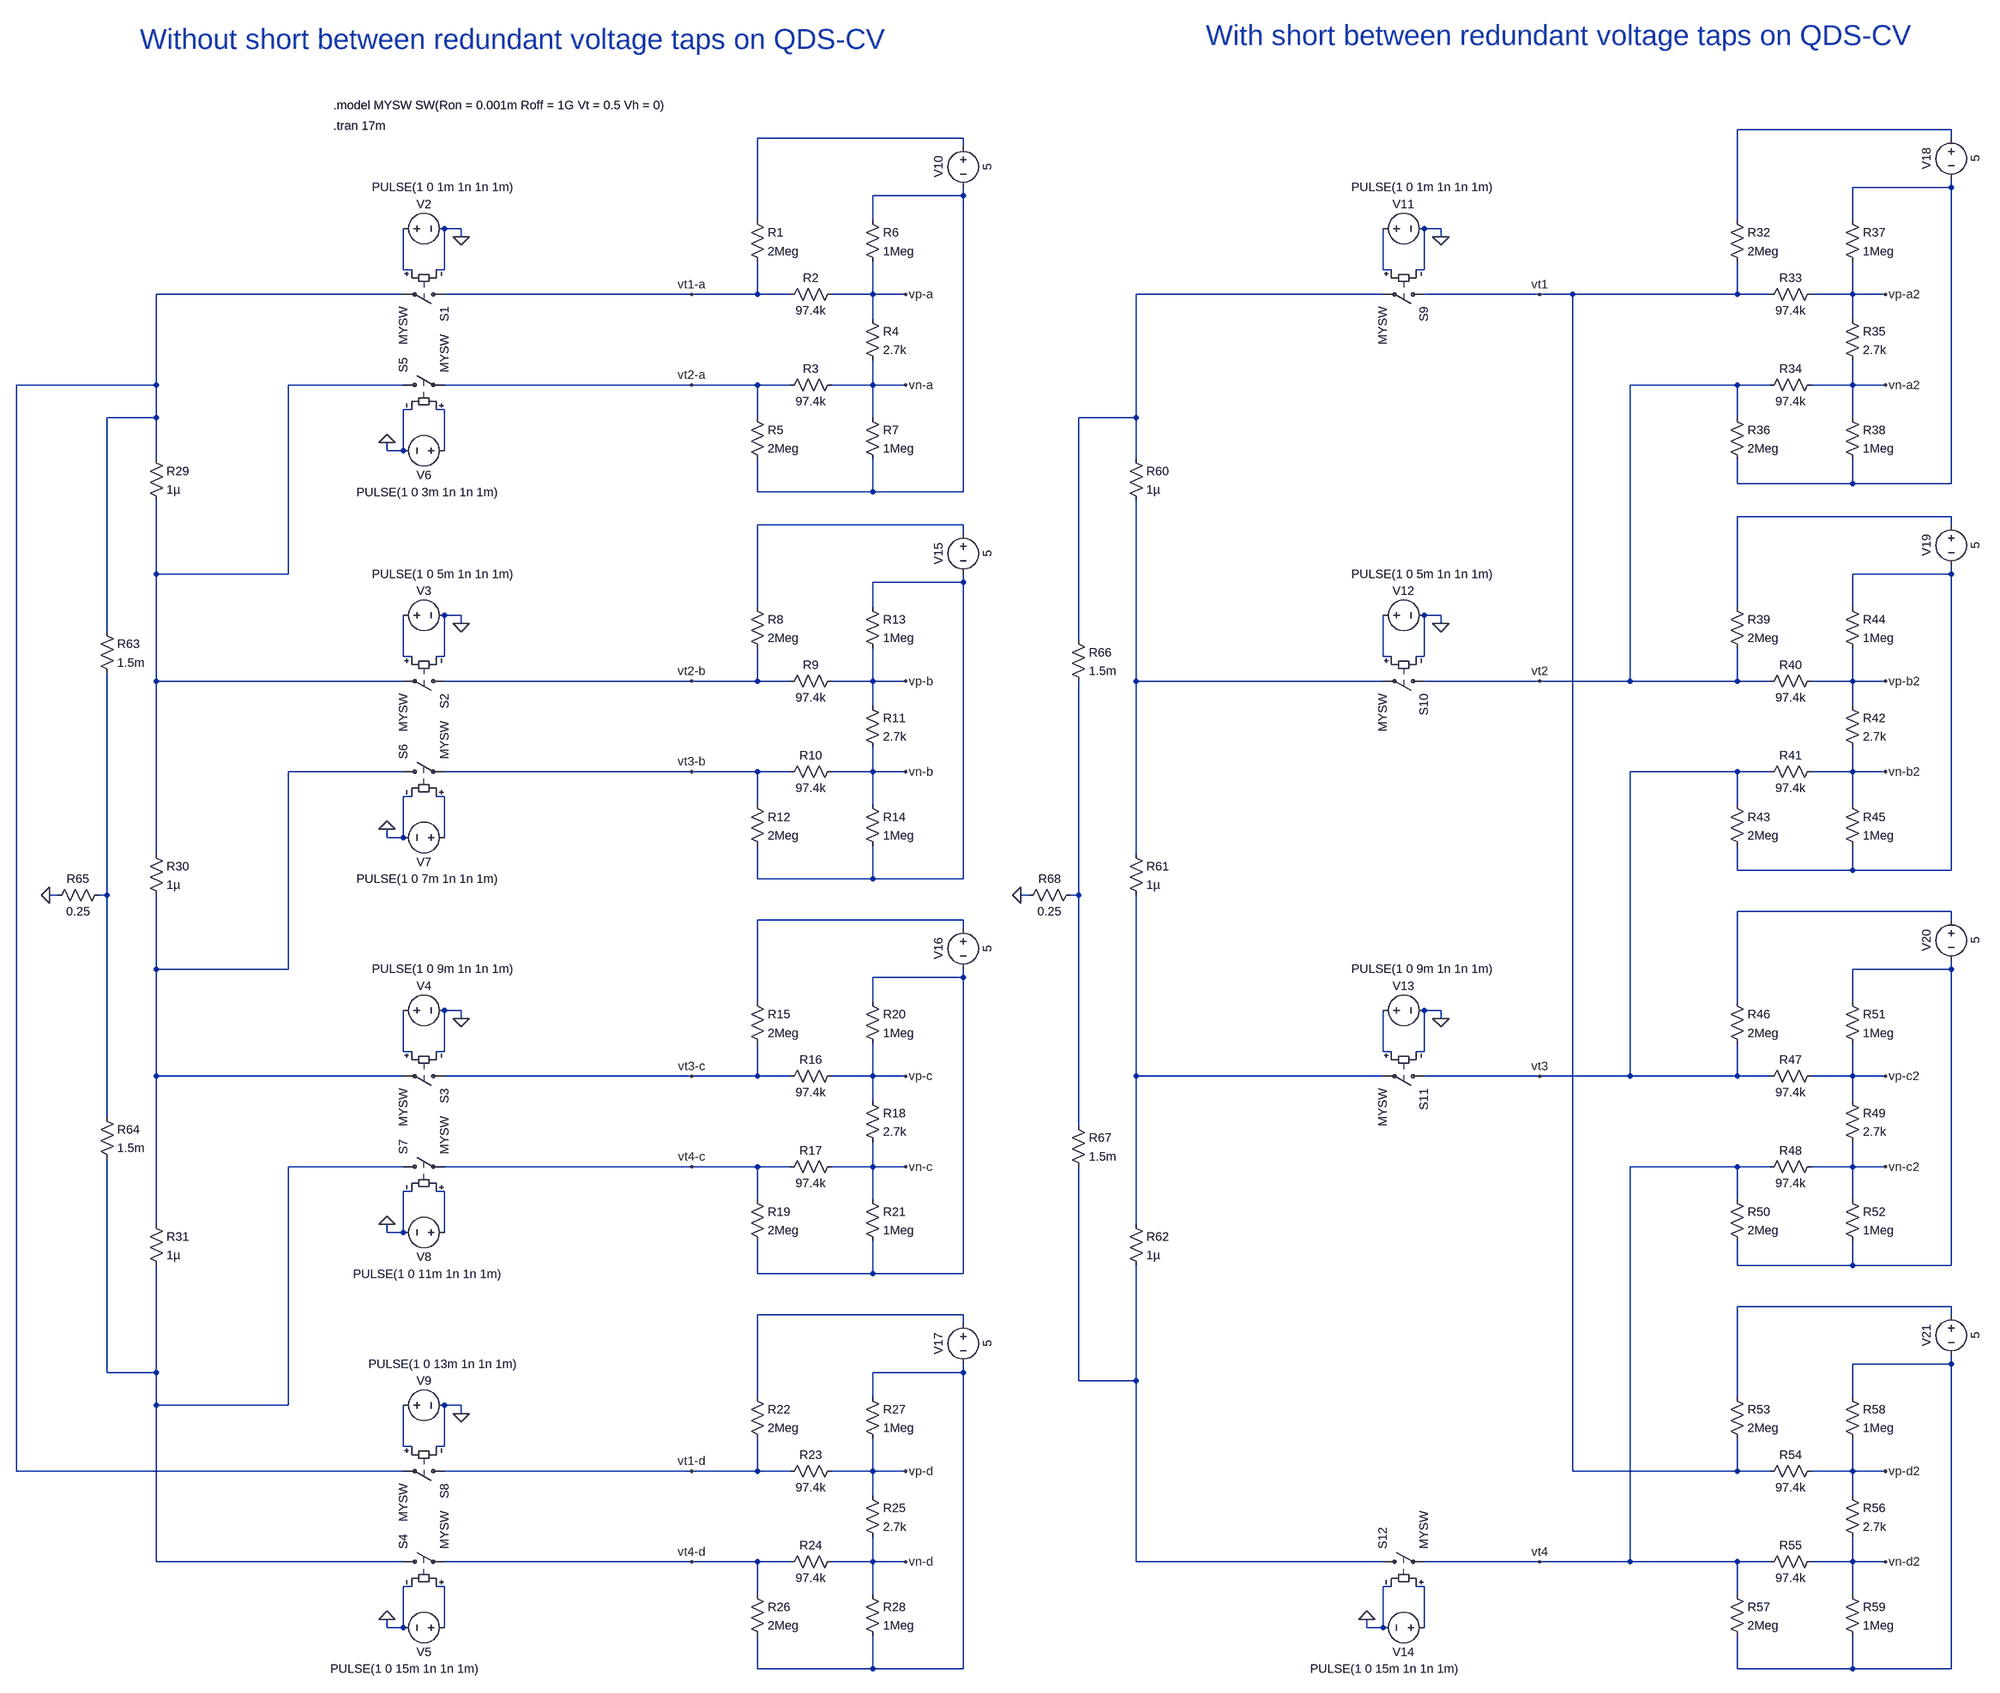
[diagram p0: schematic full-broken-wire-detection-circuit.asc]
full-broken-wire-detection-circuit.asc, the LTspice schematic file:
Version 4
SHEET 1 2824 2932
WIRE 2688 -144 2272 -144
WIRE 768 -128 368 -128
WIRE 2688 -128 2688 -144
WIRE 768 -112 768 -128
WIRE 2688 -32 2688 -48
WIRE 2688 -32 2496 -32
WIRE 768 -16 768 -32
WIRE 768 -16 592 -16
WIRE 368 32 368 -128
WIRE 592 32 592 -16
WIRE 2272 32 2272 -144
WIRE 2496 32 2496 -32
WIRE -208 48 -240 48
WIRE 1696 48 1664 48
WIRE -208 64 -208 48
WIRE 1696 64 1696 48
WIRE -320 128 -320 48
WIRE -304 128 -320 128
WIRE -240 128 -240 48
WIRE -240 128 -256 128
WIRE 1584 128 1584 48
WIRE 1600 128 1584 128
WIRE 1664 128 1664 48
WIRE 1664 128 1648 128
WIRE -320 176 -800 176
WIRE 240 176 -240 176
WIRE 368 176 368 112
WIRE 368 176 240 176
WIRE 432 176 368 176
WIRE 592 176 592 112
WIRE 592 176 512 176
WIRE 656 176 592 176
WIRE 1584 176 1104 176
WIRE 1888 176 1664 176
WIRE 1952 176 1888 176
WIRE 2272 176 2272 112
WIRE 2272 176 1952 176
WIRE 2336 176 2272 176
WIRE 2496 176 2496 112
WIRE 2496 176 2416 176
WIRE 2560 176 2496 176
WIRE 592 224 592 176
WIRE 2496 224 2496 176
WIRE -800 352 -800 176
WIRE -800 352 -1072 352
WIRE -320 352 -544 352
WIRE 240 352 -240 352
WIRE 368 352 240 352
WIRE 432 352 368 352
WIRE 592 352 592 304
WIRE 592 352 512 352
WIRE 656 352 592 352
WIRE 2272 352 2064 352
WIRE 2336 352 2272 352
WIRE 2496 352 2496 304
WIRE 2496 352 2416 352
WIRE 2560 352 2496 352
WIRE -304 400 -320 400
WIRE -240 400 -256 400
WIRE -800 416 -800 352
WIRE -800 416 -896 416
WIRE 368 416 368 352
WIRE 592 416 592 352
WIRE 1104 416 1104 176
WIRE 1104 416 992 416
WIRE 2272 416 2272 352
WIRE 2496 416 2496 352
WIRE -352 480 -352 464
WIRE -320 480 -320 400
WIRE -320 480 -352 480
WIRE -240 480 -240 400
WIRE -800 496 -800 416
WIRE 1104 496 1104 416
WIRE 2272 544 2272 496
WIRE 2496 544 2496 496
WIRE 2496 544 2272 544
WIRE 2688 544 2688 -32
WIRE 2688 544 2496 544
WIRE 368 560 368 496
WIRE 592 560 592 496
WIRE 592 560 368 560
WIRE 768 560 768 -16
WIRE 768 560 592 560
WIRE 2688 608 2272 608
WIRE 768 624 368 624
WIRE 2688 624 2688 608
WIRE 768 640 768 624
WIRE -800 720 -800 576
WIRE -544 720 -544 352
WIRE -544 720 -800 720
WIRE 2688 720 2688 704
WIRE 2688 720 2496 720
WIRE 768 736 768 720
WIRE 768 736 592 736
WIRE 368 784 368 624
WIRE 592 784 592 736
WIRE 2272 784 2272 608
WIRE 2496 784 2496 720
WIRE -208 800 -240 800
WIRE 1696 800 1664 800
WIRE -208 816 -208 800
WIRE 1696 816 1696 800
WIRE -896 832 -896 416
WIRE 992 848 992 416
WIRE -320 880 -320 800
WIRE -304 880 -320 880
WIRE -240 880 -240 800
WIRE -240 880 -256 880
WIRE 1584 880 1584 800
WIRE 1600 880 1584 880
WIRE 1664 880 1664 800
WIRE 1664 880 1648 880
WIRE -800 928 -800 720
WIRE -320 928 -800 928
WIRE 240 928 -240 928
WIRE 368 928 368 864
WIRE 368 928 240 928
WIRE 432 928 368 928
WIRE 592 928 592 864
WIRE 592 928 512 928
WIRE 656 928 592 928
WIRE 1104 928 1104 576
WIRE 1584 928 1104 928
WIRE 1888 928 1664 928
WIRE 2064 928 2064 352
WIRE 2064 928 1888 928
WIRE 2272 928 2272 864
WIRE 2272 928 2064 928
WIRE 2336 928 2272 928
WIRE 2496 928 2496 864
WIRE 2496 928 2416 928
WIRE 2560 928 2496 928
WIRE 592 976 592 928
WIRE 2496 976 2496 928
WIRE -320 1104 -544 1104
WIRE 240 1104 -240 1104
WIRE 368 1104 240 1104
WIRE 432 1104 368 1104
WIRE 592 1104 592 1056
WIRE 592 1104 512 1104
WIRE 656 1104 592 1104
WIRE 2272 1104 2064 1104
WIRE 2336 1104 2272 1104
WIRE 2496 1104 2496 1056
WIRE 2496 1104 2416 1104
WIRE 2560 1104 2496 1104
WIRE -304 1152 -320 1152
WIRE -240 1152 -256 1152
WIRE 368 1168 368 1104
WIRE 592 1168 592 1104
WIRE 2272 1168 2272 1104
WIRE 2496 1168 2496 1104
WIRE -352 1232 -352 1216
WIRE -320 1232 -320 1152
WIRE -320 1232 -352 1232
WIRE -240 1232 -240 1152
WIRE -800 1264 -800 928
WIRE 1104 1264 1104 928
WIRE 2272 1296 2272 1248
WIRE 2496 1296 2496 1248
WIRE 2496 1296 2272 1296
WIRE 2688 1296 2688 720
WIRE 2688 1296 2496 1296
WIRE 368 1312 368 1248
WIRE 592 1312 592 1248
WIRE 592 1312 368 1312
WIRE 768 1312 768 736
WIRE 768 1312 592 1312
WIRE -992 1344 -1008 1344
WIRE -896 1344 -896 912
WIRE -896 1344 -912 1344
WIRE 896 1344 880 1344
WIRE 992 1344 992 928
WIRE 992 1344 976 1344
WIRE 2688 1376 2272 1376
WIRE 768 1392 368 1392
WIRE 2688 1392 2688 1376
WIRE 768 1408 768 1392
WIRE -800 1488 -800 1344
WIRE -544 1488 -544 1104
WIRE -544 1488 -800 1488
WIRE 2688 1488 2688 1472
WIRE 2688 1488 2496 1488
WIRE 768 1504 768 1488
WIRE 768 1504 592 1504
WIRE 368 1552 368 1392
WIRE 592 1552 592 1504
WIRE 2272 1552 2272 1376
WIRE 2496 1552 2496 1488
WIRE -208 1568 -240 1568
WIRE 1696 1568 1664 1568
WIRE -208 1584 -208 1568
WIRE 1696 1584 1696 1568
WIRE -320 1648 -320 1568
WIRE -304 1648 -320 1648
WIRE -240 1648 -240 1568
WIRE -240 1648 -256 1648
WIRE 1584 1648 1584 1568
WIRE 1600 1648 1584 1648
WIRE 1664 1648 1664 1568
WIRE 1664 1648 1648 1648
WIRE -800 1696 -800 1488
WIRE -320 1696 -800 1696
WIRE 240 1696 -240 1696
WIRE 368 1696 368 1632
WIRE 368 1696 240 1696
WIRE 432 1696 368 1696
WIRE 592 1696 592 1632
WIRE 592 1696 512 1696
WIRE 656 1696 592 1696
WIRE 1104 1696 1104 1344
WIRE 1584 1696 1104 1696
WIRE 1888 1696 1664 1696
WIRE 2064 1696 2064 1104
WIRE 2064 1696 1888 1696
WIRE 2272 1696 2272 1632
WIRE 2272 1696 2064 1696
WIRE 2336 1696 2272 1696
WIRE 2496 1696 2496 1632
WIRE 2496 1696 2416 1696
WIRE 2560 1696 2496 1696
WIRE 592 1744 592 1696
WIRE 2496 1744 2496 1696
WIRE -896 1776 -896 1344
WIRE 992 1792 992 1344
WIRE -320 1872 -544 1872
WIRE 240 1872 -240 1872
WIRE 368 1872 240 1872
WIRE 432 1872 368 1872
WIRE 592 1872 592 1824
WIRE 592 1872 512 1872
WIRE 656 1872 592 1872
WIRE 2272 1872 2064 1872
WIRE 2336 1872 2272 1872
WIRE 2496 1872 2496 1824
WIRE 2496 1872 2416 1872
WIRE 2560 1872 2496 1872
WIRE -304 1920 -320 1920
WIRE -240 1920 -256 1920
WIRE 368 1936 368 1872
WIRE 592 1936 592 1872
WIRE 2272 1936 2272 1872
WIRE 2496 1936 2496 1872
WIRE -800 1984 -800 1696
WIRE 1104 1984 1104 1696
WIRE -352 2000 -352 1984
WIRE -320 2000 -320 1920
WIRE -320 2000 -352 2000
WIRE -240 2000 -240 1920
WIRE 2272 2064 2272 2016
WIRE 2496 2064 2496 2016
WIRE 2496 2064 2272 2064
WIRE 2688 2064 2688 1488
WIRE 2688 2064 2496 2064
WIRE 368 2080 368 2016
WIRE 592 2080 592 2016
WIRE 592 2080 368 2080
WIRE 768 2080 768 1504
WIRE 768 2080 592 2080
WIRE 2688 2144 2272 2144
WIRE 768 2160 368 2160
WIRE 2688 2160 2688 2144
WIRE 768 2176 768 2160
WIRE 2688 2256 2688 2240
WIRE 2688 2256 2496 2256
WIRE -896 2272 -896 1856
WIRE -800 2272 -800 2064
WIRE -800 2272 -896 2272
WIRE 768 2272 768 2256
WIRE 768 2272 592 2272
WIRE 992 2288 992 1872
WIRE 1104 2288 1104 2064
WIRE 1104 2288 992 2288
WIRE 368 2320 368 2160
WIRE 592 2320 592 2272
WIRE 2272 2320 2272 2144
WIRE 2496 2320 2496 2256
WIRE -800 2336 -800 2272
WIRE -544 2336 -544 1872
WIRE -544 2336 -800 2336
WIRE -208 2336 -240 2336
WIRE -208 2352 -208 2336
WIRE -320 2416 -320 2336
WIRE -304 2416 -320 2416
WIRE -240 2416 -240 2336
WIRE -240 2416 -256 2416
WIRE -1072 2464 -1072 352
WIRE -320 2464 -1072 2464
WIRE 240 2464 -240 2464
WIRE 368 2464 368 2400
WIRE 368 2464 240 2464
WIRE 432 2464 368 2464
WIRE 592 2464 592 2400
WIRE 592 2464 512 2464
WIRE 656 2464 592 2464
WIRE 1952 2464 1952 176
WIRE 2272 2464 2272 2400
WIRE 2272 2464 1952 2464
WIRE 2336 2464 2272 2464
WIRE 2496 2464 2496 2400
WIRE 2496 2464 2416 2464
WIRE 2560 2464 2496 2464
WIRE 592 2512 592 2464
WIRE 2496 2512 2496 2464
WIRE -800 2640 -800 2336
WIRE -320 2640 -800 2640
WIRE 240 2640 -240 2640
WIRE 368 2640 240 2640
WIRE 432 2640 368 2640
WIRE 592 2640 592 2592
WIRE 592 2640 512 2640
WIRE 656 2640 592 2640
WIRE 1104 2640 1104 2288
WIRE 1584 2640 1104 2640
WIRE 1888 2640 1664 2640
WIRE 2064 2640 2064 1872
WIRE 2064 2640 1888 2640
WIRE 2272 2640 2064 2640
WIRE 2336 2640 2272 2640
WIRE 2496 2640 2496 2592
WIRE 2496 2640 2416 2640
WIRE 2560 2640 2496 2640
WIRE -304 2688 -320 2688
WIRE -240 2688 -256 2688
WIRE 1600 2688 1584 2688
WIRE 1664 2688 1648 2688
WIRE 368 2704 368 2640
WIRE 592 2704 592 2640
WIRE 2272 2704 2272 2640
WIRE 2496 2704 2496 2640
WIRE -352 2768 -352 2752
WIRE -320 2768 -320 2688
WIRE -320 2768 -352 2768
WIRE -240 2768 -240 2688
WIRE 1552 2768 1552 2752
WIRE 1584 2768 1584 2688
WIRE 1584 2768 1552 2768
WIRE 1664 2768 1664 2688
WIRE 368 2848 368 2784
WIRE 592 2848 592 2784
WIRE 592 2848 368 2848
WIRE 768 2848 768 2272
WIRE 768 2848 592 2848
WIRE 2272 2848 2272 2784
WIRE 2496 2848 2496 2784
WIRE 2496 2848 2272 2848
WIRE 2688 2848 2688 2256
WIRE 2688 2848 2496 2848
FLAG -208 64 0
FLAG -208 816 0
FLAG -208 1584 0
FLAG -352 2752 0
FLAG 240 176 vt1-a
FLAG 240 352 vt2-a
FLAG 240 1104 vt3-b
FLAG 240 1872 vt4-c
FLAG 240 928 vt2-b
FLAG 240 1696 vt3-c
FLAG 240 2640 vt4-d
FLAG 240 2464 vt1-d
FLAG -352 464 0
FLAG -352 1216 0
FLAG -352 1984 0
FLAG -208 2352 0
FLAG 656 176 vp-a
FLAG 656 352 vn-a
FLAG 656 928 vp-b
FLAG 656 1104 vn-b
FLAG 656 1696 vp-c
FLAG 656 1872 vn-c
FLAG 656 2464 vp-d
FLAG 656 2640 vn-d
FLAG 1696 64 0
FLAG 1696 816 0
FLAG 1696 1584 0
FLAG 1552 2752 0
FLAG 1888 176 vt1
FLAG 1888 928 vt2
FLAG 1888 1696 vt3
FLAG 1888 2640 vt4
FLAG 2560 176 vp-a2
FLAG 2560 352 vn-a2
FLAG 2560 928 vp-b2
FLAG 2560 1104 vn-b2
FLAG 2560 1696 vp-c2
FLAG 2560 1872 vn-c2
FLAG 2560 2464 vp-d2
FLAG 2560 2640 vn-d2
FLAG -1008 1344 0
FLAG 880 1344 0
SYMBOL res 352 16 R0
SYMATTR InstName R1
SYMATTR Value 2Meg
SYMBOL res 528 160 R90
WINDOW 0 0 56 VBottom 2
WINDOW 3 32 56 VTop 2
SYMATTR InstName R2
SYMATTR Value 97.4k
SYMBOL res 528 336 R90
WINDOW 0 0 56 VBottom 2
WINDOW 3 32 56 VTop 2
SYMATTR InstName R3
SYMATTR Value 97.4k
SYMBOL res 576 208 R0
SYMATTR InstName R4
SYMATTR Value 2.7k
SYMBOL res 352 400 R0
SYMATTR InstName R5
SYMATTR Value 2Meg
SYMBOL sw -224 176 R90
SYMATTR InstName S1
SYMATTR Value MYSW
SYMBOL voltage -336 48 R270
WINDOW 0 32 56 VTop 2
WINDOW 3 96 93 VBottom 2
WINDOW 123 0 0 Left 0
WINDOW 39 0 0 Left 0
SYMATTR InstName V2
SYMATTR Value PULSE(1 0 1m 1n 1n 1m)
SYMBOL res 576 16 R0
SYMATTR InstName R6
SYMATTR Value 1Meg
SYMBOL res 576 400 R0
SYMATTR InstName R7
SYMATTR Value 1Meg
SYMBOL res 352 768 R0
SYMATTR InstName R8
SYMATTR Value 2Meg
SYMBOL res 528 912 R90
WINDOW 0 0 56 VBottom 2
WINDOW 3 32 56 VTop 2
SYMATTR InstName R9
SYMATTR Value 97.4k
SYMBOL res 528 1088 R90
WINDOW 0 0 56 VBottom 2
WINDOW 3 32 56 VTop 2
SYMATTR InstName R10
SYMATTR Value 97.4k
SYMBOL res 576 960 R0
SYMATTR InstName R11
SYMATTR Value 2.7k
SYMBOL res 352 1152 R0
SYMATTR InstName R12
SYMATTR Value 2Meg
SYMBOL sw -224 928 R90
SYMATTR InstName S2
SYMATTR Value MYSW
SYMBOL res 576 768 R0
SYMATTR InstName R13
SYMATTR Value 1Meg
SYMBOL res 576 1152 R0
SYMATTR InstName R14
SYMATTR Value 1Meg
SYMBOL res 352 1536 R0
SYMATTR InstName R15
SYMATTR Value 2Meg
SYMBOL res 528 1680 R90
WINDOW 0 0 56 VBottom 2
WINDOW 3 32 56 VTop 2
SYMATTR InstName R16
SYMATTR Value 97.4k
SYMBOL res 528 1856 R90
WINDOW 0 0 56 VBottom 2
WINDOW 3 32 56 VTop 2
SYMATTR InstName R17
SYMATTR Value 97.4k
SYMBOL res 576 1728 R0
SYMATTR InstName R18
SYMATTR Value 2.7k
SYMBOL res 352 1920 R0
SYMATTR InstName R19
SYMATTR Value 2Meg
SYMBOL sw -224 1696 R90
SYMATTR InstName S3
SYMATTR Value MYSW
SYMBOL res 576 1536 R0
SYMATTR InstName R20
SYMATTR Value 1Meg
SYMBOL res 576 1920 R0
SYMATTR InstName R21
SYMATTR Value 1Meg
SYMBOL res 352 2304 R0
SYMATTR InstName R22
SYMATTR Value 2Meg
SYMBOL res 528 2448 R90
WINDOW 0 0 56 VBottom 2
WINDOW 3 32 56 VTop 2
SYMATTR InstName R23
SYMATTR Value 97.4k
SYMBOL res 528 2624 R90
WINDOW 0 0 56 VBottom 2
WINDOW 3 32 56 VTop 2
SYMATTR InstName R24
SYMATTR Value 97.4k
SYMBOL res 576 2496 R0
SYMATTR InstName R25
SYMATTR Value 2.7k
SYMBOL res 352 2688 R0
SYMATTR InstName R26
SYMATTR Value 2Meg
SYMBOL sw -336 2640 R270
SYMATTR InstName S4
SYMATTR Value MYSW
SYMBOL res 576 2304 R0
SYMATTR InstName R27
SYMATTR Value 1Meg
SYMBOL res 576 2688 R0
SYMATTR InstName R28
SYMATTR Value 1Meg
SYMBOL res -816 480 R0
SYMATTR InstName R29
SYMATTR Value 1µ
SYMBOL res -816 1248 R0
SYMATTR InstName R30
SYMATTR Value 1µ
SYMBOL res -816 1968 R0
SYMATTR InstName R31
SYMATTR Value 1µ
SYMBOL voltage -336 800 R270
WINDOW 0 32 56 VTop 2
WINDOW 3 96 93 VBottom 2
WINDOW 123 0 0 Left 0
WINDOW 39 0 0 Left 0
SYMATTR InstName V3
SYMATTR Value PULSE(1 0 5m 1n 1n 1m)
SYMBOL voltage -336 1568 R270
WINDOW 0 32 56 VTop 2
WINDOW 3 96 93 VBottom 2
WINDOW 123 0 0 Left 0
WINDOW 39 0 0 Left 0
SYMATTR InstName V4
SYMATTR Value PULSE(1 0 9m 1n 1n 1m)
SYMBOL voltage -224 2768 R90
WINDOW 0 32 56 VTop 2
WINDOW 3 96 93 VBottom 2
WINDOW 123 0 0 Left 0
WINDOW 39 0 0 Left 0
SYMATTR InstName V5
SYMATTR Value PULSE(1 0 15m 1n 1n 1m)
SYMBOL sw -336 352 R270
SYMATTR InstName S5
SYMATTR Value MYSW
SYMBOL voltage -224 480 R90
WINDOW 0 32 56 VTop 2
WINDOW 3 96 49 VBottom 2
WINDOW 123 0 0 Left 0
WINDOW 39 0 0 Left 0
SYMATTR InstName V6
SYMATTR Value PULSE(1 0 3m 1n 1n 1m)
SYMBOL sw -336 1104 R270
SYMATTR InstName S6
SYMATTR Value MYSW
SYMBOL voltage -224 1232 R90
WINDOW 0 32 56 VTop 2
WINDOW 3 96 49 VBottom 2
WINDOW 123 0 0 Left 0
WINDOW 39 0 0 Left 0
SYMATTR InstName V7
SYMATTR Value PULSE(1 0 7m 1n 1n 1m)
SYMBOL sw -336 1872 R270
SYMATTR InstName S7
SYMATTR Value MYSW
SYMBOL voltage -224 2000 R90
WINDOW 0 32 56 VTop 2
WINDOW 3 96 49 VBottom 2
WINDOW 123 0 0 Left 0
WINDOW 39 0 0 Left 0
SYMATTR InstName V8
SYMATTR Value PULSE(1 0 11m 1n 1n 1m)
SYMBOL sw -224 2464 R90
SYMATTR InstName S8
SYMATTR Value MYSW
SYMBOL voltage -336 2336 R270
WINDOW 0 32 56 VTop 2
WINDOW 3 96 93 VBottom 2
WINDOW 123 0 0 Left 0
WINDOW 39 0 0 Left 0
SYMATTR InstName V9
SYMATTR Value PULSE(1 0 13m 1n 1n 1m)
SYMBOL res 2256 16 R0
SYMATTR InstName R32
SYMATTR Value 2Meg
SYMBOL res 2432 160 R90
WINDOW 0 0 56 VBottom 2
WINDOW 3 32 56 VTop 2
SYMATTR InstName R33
SYMATTR Value 97.4k
SYMBOL res 2432 336 R90
WINDOW 0 0 56 VBottom 2
WINDOW 3 32 56 VTop 2
SYMATTR InstName R34
SYMATTR Value 97.4k
SYMBOL res 2480 208 R0
SYMATTR InstName R35
SYMATTR Value 2.7k
SYMBOL res 2256 400 R0
SYMATTR InstName R36
SYMATTR Value 2Meg
SYMBOL sw 1680 176 R90
SYMATTR InstName S9
SYMATTR Value MYSW
SYMBOL voltage 1568 48 R270
WINDOW 0 32 56 VTop 2
WINDOW 3 96 93 VBottom 2
WINDOW 123 0 0 Left 0
WINDOW 39 0 0 Left 0
SYMATTR InstName V11
SYMATTR Value PULSE(1 0 1m 1n 1n 1m)
SYMBOL res 2480 16 R0
SYMATTR InstName R37
SYMATTR Value 1Meg
SYMBOL res 2480 400 R0
SYMATTR InstName R38
SYMATTR Value 1Meg
SYMBOL res 2256 768 R0
SYMATTR InstName R39
SYMATTR Value 2Meg
SYMBOL res 2432 912 R90
WINDOW 0 0 56 VBottom 2
WINDOW 3 32 56 VTop 2
SYMATTR InstName R40
SYMATTR Value 97.4k
SYMBOL res 2432 1088 R90
WINDOW 0 0 56 VBottom 2
WINDOW 3 32 56 VTop 2
SYMATTR InstName R41
SYMATTR Value 97.4k
SYMBOL res 2480 960 R0
SYMATTR InstName R42
SYMATTR Value 2.7k
SYMBOL res 2256 1152 R0
SYMATTR InstName R43
SYMATTR Value 2Meg
SYMBOL sw 1680 928 R90
SYMATTR InstName S10
SYMATTR Value MYSW
SYMBOL res 2480 768 R0
SYMATTR InstName R44
SYMATTR Value 1Meg
SYMBOL res 2480 1152 R0
SYMATTR InstName R45
SYMATTR Value 1Meg
SYMBOL res 2256 1536 R0
SYMATTR InstName R46
SYMATTR Value 2Meg
SYMBOL res 2432 1680 R90
WINDOW 0 0 56 VBottom 2
WINDOW 3 32 56 VTop 2
SYMATTR InstName R47
SYMATTR Value 97.4k
SYMBOL res 2432 1856 R90
WINDOW 0 0 56 VBottom 2
WINDOW 3 32 56 VTop 2
SYMATTR InstName R48
SYMATTR Value 97.4k
SYMBOL res 2480 1728 R0
SYMATTR InstName R49
SYMATTR Value 2.7k
SYMBOL res 2256 1920 R0
SYMATTR InstName R50
SYMATTR Value 2Meg
SYMBOL sw 1680 1696 R90
SYMATTR InstName S11
SYMATTR Value MYSW
SYMBOL res 2480 1536 R0
SYMATTR InstName R51
SYMATTR Value 1Meg
SYMBOL res 2480 1920 R0
SYMATTR InstName R52
SYMATTR Value 1Meg
SYMBOL res 2256 2304 R0
SYMATTR InstName R53
SYMATTR Value 2Meg
SYMBOL res 2432 2448 R90
WINDOW 0 0 56 VBottom 2
WINDOW 3 32 56 VTop 2
SYMATTR InstName R54
SYMATTR Value 97.4k
SYMBOL res 2432 2624 R90
WINDOW 0 0 56 VBottom 2
WINDOW 3 32 56 VTop 2
SYMATTR InstName R55
SYMATTR Value 97.4k
SYMBOL res 2480 2496 R0
SYMATTR InstName R56
SYMATTR Value 2.7k
SYMBOL res 2256 2688 R0
SYMATTR InstName R57
SYMATTR Value 2Meg
SYMBOL sw 1568 2640 R270
SYMATTR InstName S12
SYMATTR Value MYSW
SYMBOL res 2480 2304 R0
SYMATTR InstName R58
SYMATTR Value 1Meg
SYMBOL res 2480 2688 R0
SYMATTR InstName R59
SYMATTR Value 1Meg
SYMBOL res 1088 480 R0
SYMATTR InstName R60
SYMATTR Value 1µ
SYMBOL res 1088 1248 R0
SYMATTR InstName R61
SYMATTR Value 1µ
SYMBOL res 1088 1968 R0
SYMATTR InstName R62
SYMATTR Value 1µ
SYMBOL voltage 1568 800 R270
WINDOW 0 32 56 VTop 2
WINDOW 3 96 93 VBottom 2
WINDOW 123 0 0 Left 0
WINDOW 39 0 0 Left 0
SYMATTR InstName V12
SYMATTR Value PULSE(1 0 5m 1n 1n 1m)
SYMBOL voltage 1568 1568 R270
WINDOW 0 32 56 VTop 2
WINDOW 3 96 93 VBottom 2
WINDOW 123 0 0 Left 0
WINDOW 39 0 0 Left 0
SYMATTR InstName V13
SYMATTR Value PULSE(1 0 9m 1n 1n 1m)
SYMBOL voltage 1680 2768 R90
WINDOW 0 32 56 VTop 2
WINDOW 3 96 93 VBottom 2
WINDOW 123 0 0 Left 0
WINDOW 39 0 0 Left 0
SYMATTR InstName V14
SYMATTR Value PULSE(1 0 15m 1n 1n 1m)
SYMBOL voltage 768 -128 R0
WINDOW 0 -32 56 VBottom 2
WINDOW 3 32 56 VTop 2
WINDOW 123 0 0 Left 0
WINDOW 39 0 0 Left 0
SYMATTR InstName V10
SYMATTR Value 5
SYMBOL voltage 768 624 R0
WINDOW 0 -32 56 VBottom 2
WINDOW 3 32 56 VTop 2
WINDOW 123 0 0 Left 0
WINDOW 39 0 0 Left 0
SYMATTR InstName V15
SYMATTR Value 5
SYMBOL voltage 768 1392 R0
WINDOW 0 -32 56 VBottom 2
WINDOW 3 32 56 VTop 2
WINDOW 123 0 0 Left 0
WINDOW 39 0 0 Left 0
SYMATTR InstName V16
SYMATTR Value 5
SYMBOL voltage 768 2160 R0
WINDOW 0 -32 56 VBottom 2
WINDOW 3 32 56 VTop 2
WINDOW 123 0 0 Left 0
WINDOW 39 0 0 Left 0
SYMATTR InstName V17
SYMATTR Value 5
SYMBOL res -912 816 R0
SYMATTR InstName R63
SYMATTR Value 1.5m
SYMBOL res -912 1760 R0
SYMATTR InstName R64
SYMATTR Value 1.5m
SYMBOL res -896 1328 R90
WINDOW 0 0 56 VBottom 2
WINDOW 3 32 56 VTop 2
SYMATTR InstName R65
SYMATTR Value 0.25
SYMBOL voltage 2688 -144 R0
WINDOW 0 -32 56 VBottom 2
WINDOW 3 32 56 VTop 2
WINDOW 123 0 0 Left 0
WINDOW 39 0 0 Left 0
SYMATTR InstName V18
SYMATTR Value 5
SYMBOL voltage 2688 608 R0
WINDOW 0 -32 56 VBottom 2
WINDOW 3 32 56 VTop 2
WINDOW 123 0 0 Left 0
WINDOW 39 0 0 Left 0
SYMATTR InstName V19
SYMATTR Value 5
SYMBOL voltage 2688 1376 R0
WINDOW 0 -32 56 VBottom 2
WINDOW 3 32 56 VTop 2
WINDOW 123 0 0 Left 0
WINDOW 39 0 0 Left 0
SYMATTR InstName V20
SYMATTR Value 5
SYMBOL voltage 2688 2144 R0
WINDOW 0 -32 56 VBottom 2
WINDOW 3 32 56 VTop 2
WINDOW 123 0 0 Left 0
WINDOW 39 0 0 Left 0
SYMATTR InstName V21
SYMATTR Value 5
SYMBOL res 976 832 R0
SYMATTR InstName R66
SYMATTR Value 1.5m
SYMBOL res 976 1776 R0
SYMATTR InstName R67
SYMATTR Value 1.5m
SYMBOL res 992 1328 R90
WINDOW 0 0 56 VBottom 2
WINDOW 3 32 56 VTop 2
SYMATTR InstName R68
SYMATTR Value 0.25
TEXT -456 -152 Left 2 !.tran 17m
TEXT -456 -192 Left 2 !.model MYSW SW(Ron = 0.001m Roff = 1G Vt = 0.5 Vh = 0)
TEXT -832 -320 Left 5 ;Without short between redundant voltage taps on QDS-CV
TEXT 1240 -328 Left 5 ;With short between redundant voltage taps on QDS-CV

The netlist it stands for:
* full-broken-wire-detection-circuit.asc
R1 N002 vt1-a 2Meg
R2 vp-a vt1-a 97.4k
R3 vn-a vt2-a 97.4k
R4 vp-a vn-a 2.7k
R5 vt2-a N004 2Meg
S1 vt1-a N007 N005 0 MYSW
V2 N005 0 PULSE(1 0 1m 1n 1n 1m)
R6 N004 vp-a 1Meg
R7 vn-a N004 1Meg
R8 N012 vt2-b 2Meg
R9 vp-b vt2-b 97.4k
R10 vn-b vt3-b 97.4k
R11 vp-b vn-b 2.7k
R12 vt3-b N014 2Meg
S2 vt2-b N009 N015 0 MYSW
R13 N014 vp-b 1Meg
R14 vn-b N014 1Meg
R15 N023 vt3-c 2Meg
R16 vp-c vt3-c 97.4k
R17 vn-c vt4-c 97.4k
R18 vp-c vn-c 2.7k
R19 vt4-c N025 2Meg
S3 vt3-c N018 N026 0 MYSW
R20 N025 vp-c 1Meg
R21 vn-c N025 1Meg
R22 N032 vt1-d 2Meg
R23 vp-d vt1-d 97.4k
R24 vn-d vt4-d 97.4k
R25 vp-d vn-d 2.7k
R26 vt4-d N034 2Meg
S4 N029 vt4-d N037 0 MYSW
R27 N034 vp-d 1Meg
R28 vn-d N034 1Meg
R29 N007 N009 1µ
R30 N009 N018 1µ
R31 N018 N029 1µ
V3 N015 0 PULSE(1 0 5m 1n 1n 1m)
V4 N026 0 PULSE(1 0 9m 1n 1n 1m)
V5 N037 0 PULSE(1 0 15m 1n 1n 1m)
S5 N009 vt2-a N010 0 MYSW
V6 N010 0 PULSE(1 0 3m 1n 1n 1m)
S6 N018 vt3-b N019 0 MYSW
V7 N019 0 PULSE(1 0 7m 1n 1n 1m)
S7 N029 vt4-c N030 0 MYSW
V8 N030 0 PULSE(1 0 11m 1n 1n 1m)
S8 vt1-d N007 N036 0 MYSW
V9 N036 0 PULSE(1 0 13m 1n 1n 1m)
R32 N001 vt1 2Meg
R33 vp-a2 vt1 97.4k
R34 vn-a2 vt2 97.4k
R35 vp-a2 vn-a2 2.7k
R36 vt2 N003 2Meg
S9 vt1 N008 N006 0 MYSW
V11 N006 0 PULSE(1 0 1m 1n 1n 1m)
R37 N003 vp-a2 1Meg
R38 vn-a2 N003 1Meg
R39 N011 vt2 2Meg
R40 vp-b2 vt2 97.4k
R41 vn-b2 vt3 97.4k
R42 vp-b2 vn-b2 2.7k
R43 vt3 N013 2Meg
S10 vt2 N017 N016 0 MYSW
R44 N013 vp-b2 1Meg
R45 vn-b2 N013 1Meg
R46 N022 vt3 2Meg
R47 vp-c2 vt3 97.4k
R48 vn-c2 vt4 97.4k
R49 vp-c2 vn-c2 2.7k
R50 vt4 N024 2Meg
S11 vt3 N028 N027 0 MYSW
R51 N024 vp-c2 1Meg
R52 vn-c2 N024 1Meg
R53 N031 vt1 2Meg
R54 vp-d2 vt1 97.4k
R55 vn-d2 vt4 97.4k
R56 vp-d2 vn-d2 2.7k
R57 vt4 N033 2Meg
S12 N035 vt4 N038 0 MYSW
R58 N033 vp-d2 1Meg
R59 vn-d2 N033 1Meg
R60 N008 N017 1µ
R61 N017 N028 1µ
R62 N028 N035 1µ
V12 N016 0 PULSE(1 0 5m 1n 1n 1m)
V13 N027 0 PULSE(1 0 9m 1n 1n 1m)
V14 N038 0 PULSE(1 0 15m 1n 1n 1m)
V10 N002 N004 5
V15 N012 N014 5
V16 N023 N025 5
V17 N032 N034 5
R63 N007 N020 1.5m
R64 N020 N029 1.5m
R65 N020 0 0.25
V18 N001 N003 5
V19 N011 N013 5
V20 N022 N024 5
V21 N031 N033 5
R66 N008 N021 1.5m
R67 N021 N035 1.5m
R68 N021 0 0.25
.tran 17m
.model MYSW SW(Ron = 0.001m Roff = 1G Vt = 0.5 Vh = 0)
* Without short between redundant voltage taps on QDS-CV
* With short between redundant voltage taps on QDS-CV
.backanno
.end

* Results of the author's LTspice run, read from the files saved beside the schematic
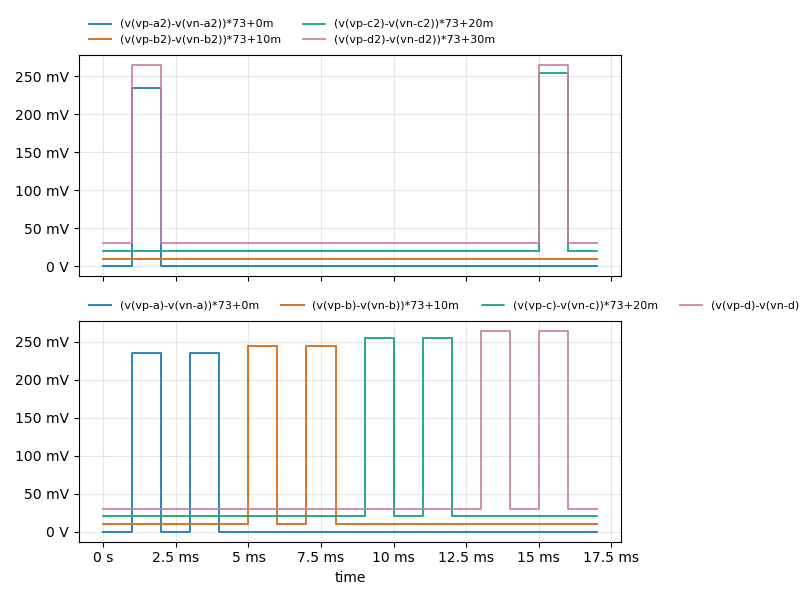
[diagram p1: Transient Analysis of full-broken-wire-detection-circuit.asc, plotted from the saved traces]
* Transient Analysis, 1 run:
*   (v(vp-a2)-v(vn-a2))*73+0m: min 0 V, max 234.4 mV, average 13.79 mV, rms 56.86 mV, last 0 V
*   (v(vp-b2)-v(vn-b2))*73+10m: min 10 mV, max 10 mV, average 10 mV, rms 10 mV, last 10 mV
*   (v(vp-c2)-v(vn-c2))*73+20m: min 20 mV, max 254.4 mV, average 33.79 mV, rms 64.69 mV, last 20 mV
*   (v(vp-d2)-v(vn-d2))*73+30m: min 30 mV, max 264.4 mV, average 57.58 mV, rms 94.98 mV, last 30 mV
*   (v(vp-a)-v(vn-a))*73+0m: min 0 V, max 234.4 mV, average 27.58 mV, rms 80.41 mV, last 0 V
*   (v(vp-b)-v(vn-b))*73+10m: min 10 mV, max 244.4 mV, average 37.58 mV, rms 84.36 mV, last 10 mV
*   (v(vp-c)-v(vn-c))*73+20m: min 20 mV, max 254.4 mV, average 47.58 mV, rms 89.27 mV, last 20 mV
*   (v(vp-d)-v(vn-d))*73+30m: min 30 mV, max 264.4 mV, average 57.58 mV, rms 94.97 mV, last 30 mV